# Altium project LCboardRev3.PrjPcb
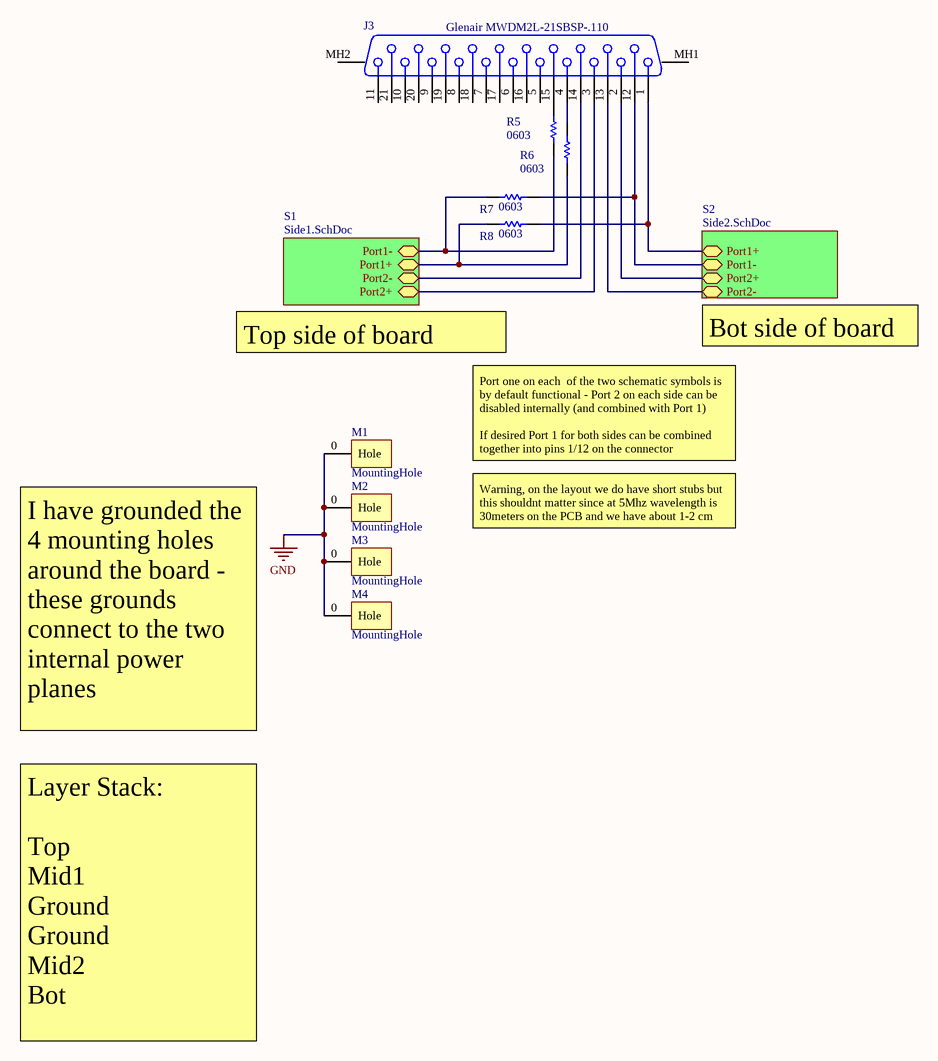
[diagram p0: LCboardRev3.SchDoc]
3 sheets, 27 parts. Net scope: hierarchical (ports join the sheet entries above them; power ports are global).
Board file: LCboardPCB3.PcbDoc
Sheets:
  LCboardRev3.SchDoc
    S2 = Side2.SchDoc
    S1 = Side1.SchDoc

## Sheet LCboardRev3.SchDoc
size Letter

### Parts
J3  Glenair MWDM2L-21SBSP-.110  [MicroD21Glenair-Vert2row]
M1  MountingHole  [MountingHole]
M2  MountingHole  [MountingHole]
M3  MountingHole  [MountingHole]
M4  MountingHole  [MountingHole]
R5  0603  [0603]
R6  0603  [0603]
R7  0603  [0603]
R8  0603  [0603]

### Sub-sheets
S1 = Side1.SchDoc: Port1+, Port1-, Port2+, Port2-
S2 = Side2.SchDoc: Port1+, Port1-, Port2+, Port2-

### Nets
GND: M1.0(Hole) M2.0(Hole) M3.0(Hole) M4.0(Hole)
NetJ1_3: R5.1 R7.1 ; sheet S1/Port1-
NetJ2_13: J3.12 R7.2 ; sheet S2/Port1-
NetJ3_1: J3.1 R8.2 ; sheet S2/Port1+
NetJ3_2: J3.2 ; sheet S2/Port2+
NetJ3_3: J3.3 ; sheet S1/Port2+
NetJ3_4: J3.4 R6.2
NetJ3_13: J3.13 ; sheet S2/Port2-
NetJ3_14: J3.14 ; sheet S1/Port2-
NetJ3_15: J3.15 R5.2
NetR6_1: R6.1 R8.1 ; sheet S1/Port1+

Not connected (* = marked no-connect by the designer): J3 5 6 7 8 9 10 11 16 17 18 19 20 21 MH1 MH2

### Notes on the sheet
- Top side of board
- Bot side of board
- Port one on each  of the two schematic symbols is by default functional - Port 2 on each side can be disabled internally (and combined with Port 1)
  If desired Port 1 for both sides can be combined together into pins 1/12 on the connector
- Warning, on the layout we do have short stubs but this shouldnt matter since at 5Mhz wavelength is 30meters on the PCB and we have about 1-2 cm
- I have grounded the 4 mounting holes around the board - these grounds connect to the two internal power planes
- Layer Stack:
  Top
  Mid1
  Ground
  Ground
  Mid2
  Bot

### Library data of the parts
J3 = GlenairMicroDsub21 -2 row
R5-R8 = Res0603: RES 1 OHM 1/10W 1% 0603 SMD; Value: 1; TechInfo: *

## Sheet Side2.SchDoc
size Letter
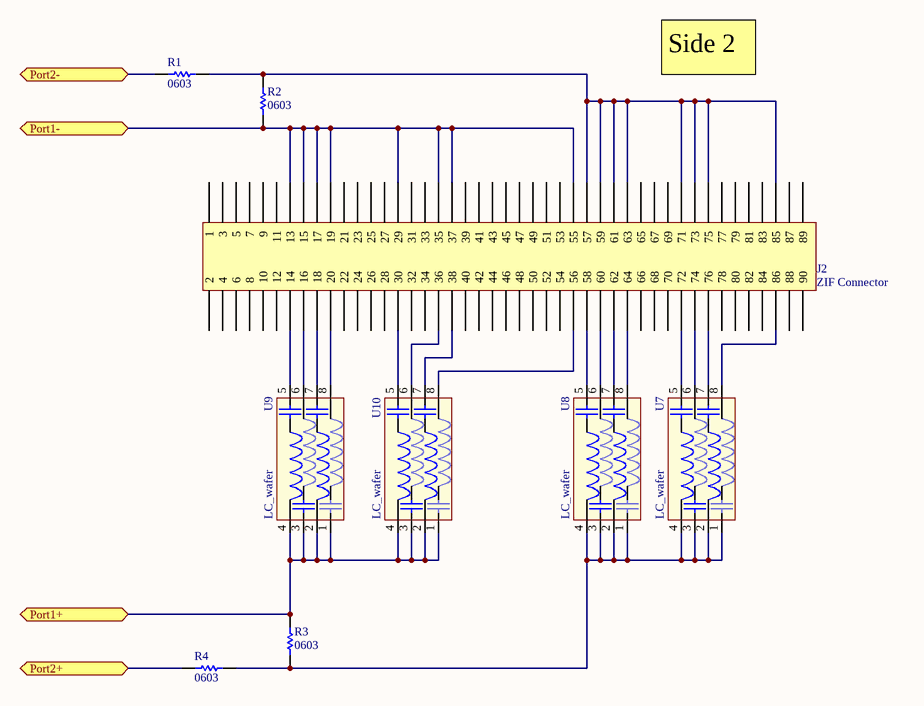
[diagram p1: Side2.SchDoc]

### Parts
J2  ZIF Connector  [LCBoard_ZIFCon]
R1  0603  [0603]
R2  0603  [0603]
R3  0603  [0603]
R4  0603  [0603]
U7  LC_wafer  [LCWafer]
U8  LC_wafer  [LCWafer]
U9  LC_wafer  [LCWafer]
U10  LC_wafer  [LCWafer]

### Ports
Port1+, Port1-, Port2+, Port2-

### Nets
NetJ2_13: J2.13 J2.15 J2.17 J2.19 J2.29 J2.35 J2.37 J2.55 R2.1 ; port Port1-
NetJ2_14: J2.14 U9.5
NetJ2_16: J2.16 U9.6
NetJ2_18: J2.18 U9.7
NetJ2_20: J2.20 U9.8
NetJ2_30: J2.30 U10.5
NetJ2_36: J2.36 U10.6
NetJ2_38: J2.38 U10.7
NetJ2_56: J2.56 U10.8
NetJ2_57: J2.57 J2.59 J2.61 J2.63 J2.71 J2.73 J2.75 J2.85 R1.1 R2.2
NetJ2_58: J2.58 U8.5
NetJ2_60: J2.60 U8.6
NetJ2_62: J2.62 U8.7
NetJ2_64: J2.64 U8.8
NetJ2_72: J2.72 U7.5
NetJ2_74: J2.74 U7.6
NetJ2_76: J2.76 U7.7
NetJ2_86: J2.86 U7.8
NetJ3_1: R3.2 U9.1 U9.2 U9.3 U9.4 U10.1 U10.2 U10.3 U10.4 ; port Port1+
NetJ3_2: R4.2 ; port Port2+
NetJ3_13: R1.2 ; port Port2-
NetR3_1: R3.1 R4.1 U7.1 U7.2 U7.3 U7.4 U8.1 U8.2 U8.3 U8.4

Not connected (* = marked no-connect by the designer): J2 1 2 3 4 5 6 7 8 9 10 11 12 21 22 23 24 25 26 27 28 31 32 33 34 39 40 41 42 43 44 45 46 47 48 49 50 51 52 53 54 65 66 67 68 69 70 77 78 79 80 81 82 83 84 87 88 89 90

### Notes on the sheet
- Side 2

### Library data of the parts
J2 = LCboard_FH16-90S-0.3SHW(05)
R1-R4 = Res0603: RES 1 OHM 1/10W 1% 0603 SMD; Value: 1; TechInfo: *
U7-U10 = LCWafer: Gold bonded integrated LC

## Sheet Side1.SchDoc
size Letter
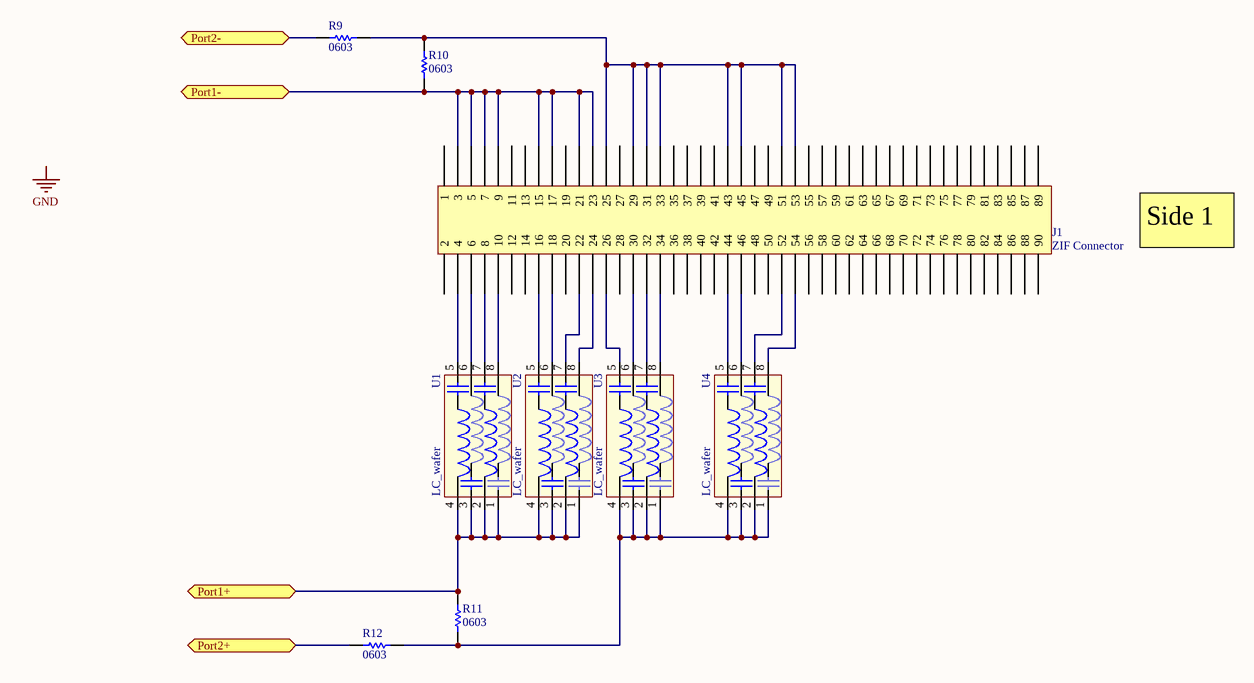
[diagram p2: Side1.SchDoc]

### Parts
J1  ZIF Connector  [LCBoard_ZIFCon]
R9  0603  [0603]
R10  0603  [0603]
R11  0603  [0603]
R12  0603  [0603]
U1  LC_wafer  [LCWafer]
U2  LC_wafer  [LCWafer]
U3  LC_wafer  [LCWafer]
U4  LC_wafer  [LCWafer]

### Ports
Port1+, Port1-, Port2+, Port2-

### Nets
NetJ1_3: J1.3 J1.5 J1.7 J1.9 J1.15 J1.17 J1.21 J1.23 R10.1 ; port Port1-
NetJ1_4: J1.4 U1.5
NetJ1_6: J1.6 U1.6
NetJ1_8: J1.8 U1.7
NetJ1_10: J1.10 U1.8
NetJ1_16: J1.16 U2.5
NetJ1_18: J1.18 U2.6
NetJ1_22: J1.22 U2.7
NetJ1_24: J1.24 U2.8
NetJ1_25: J1.25 J1.29 J1.31 J1.33 J1.43 J1.45 J1.51 J1.53 R9.1 R10.2
NetJ1_26: J1.26 U3.5
NetJ1_30: J1.30 U3.6
NetJ1_32: J1.32 U3.7
NetJ1_34: J1.34 U3.8
NetJ1_44: J1.44 U4.5
NetJ1_46: J1.46 U4.6
NetJ1_52: J1.52 U4.7
NetJ1_54: J1.54 U4.8
NetJ3_3: R12.2 ; port Port2+
NetJ3_14: R9.2 ; port Port2-
NetR6_1: R11.2 U1.1 U1.2 U1.3 U1.4 U2.1 U2.2 U2.3 U2.4 ; port Port1+
NetR11_1: R11.1 R12.1 U3.1 U3.2 U3.3 U3.4 U4.1 U4.2 U4.3 U4.4

Not connected (* = marked no-connect by the designer): J1 1 2 11 12 13 14 19 20 27 28 35 36 37 38 39 40 41 42 47 48 49 50 55 56 57 58 59 60 61 62 63 64 65 66 67 68 69 70 71 72 73 74 75 76 77 78 79 80 81 82 83 84 85 86 87 88 89 90

### Notes on the sheet
- Side 1
- Labels drawn without touching a wire or pin: GND

### Library data of the parts
J1 = LCboard_FH16-90S-0.3SHW(05)
R9-R12 = Res0603: RES 1 OHM 1/10W 1% 0603 SMD; Value: 1; TechInfo: *
U1-U4 = LCWafer: Gold bonded integrated LC

## Nets that join several sheets
NetJ1_3: LCboardRev3 (R5.1 R7.1), Side1 (9 pins)
NetJ2_13: LCboardRev3 (J3.12 R7.2), Side2 (9 pins)
NetJ3_1: LCboardRev3 (J3.1 R8.2), Side2 (9 pins)
NetJ3_2: LCboardRev3 (J3.2), Side2 (R4.2)
NetJ3_3: LCboardRev3 (J3.3), Side1 (R12.2)
NetJ3_13: LCboardRev3 (J3.13), Side2 (R1.2)
NetJ3_14: LCboardRev3 (J3.14), Side1 (R9.2)
NetR6_1: LCboardRev3 (R6.1 R8.1), Side1 (9 pins)